# Altium schematic sheet Voltage_Booster.SchDoc
size 508 x 241 mm
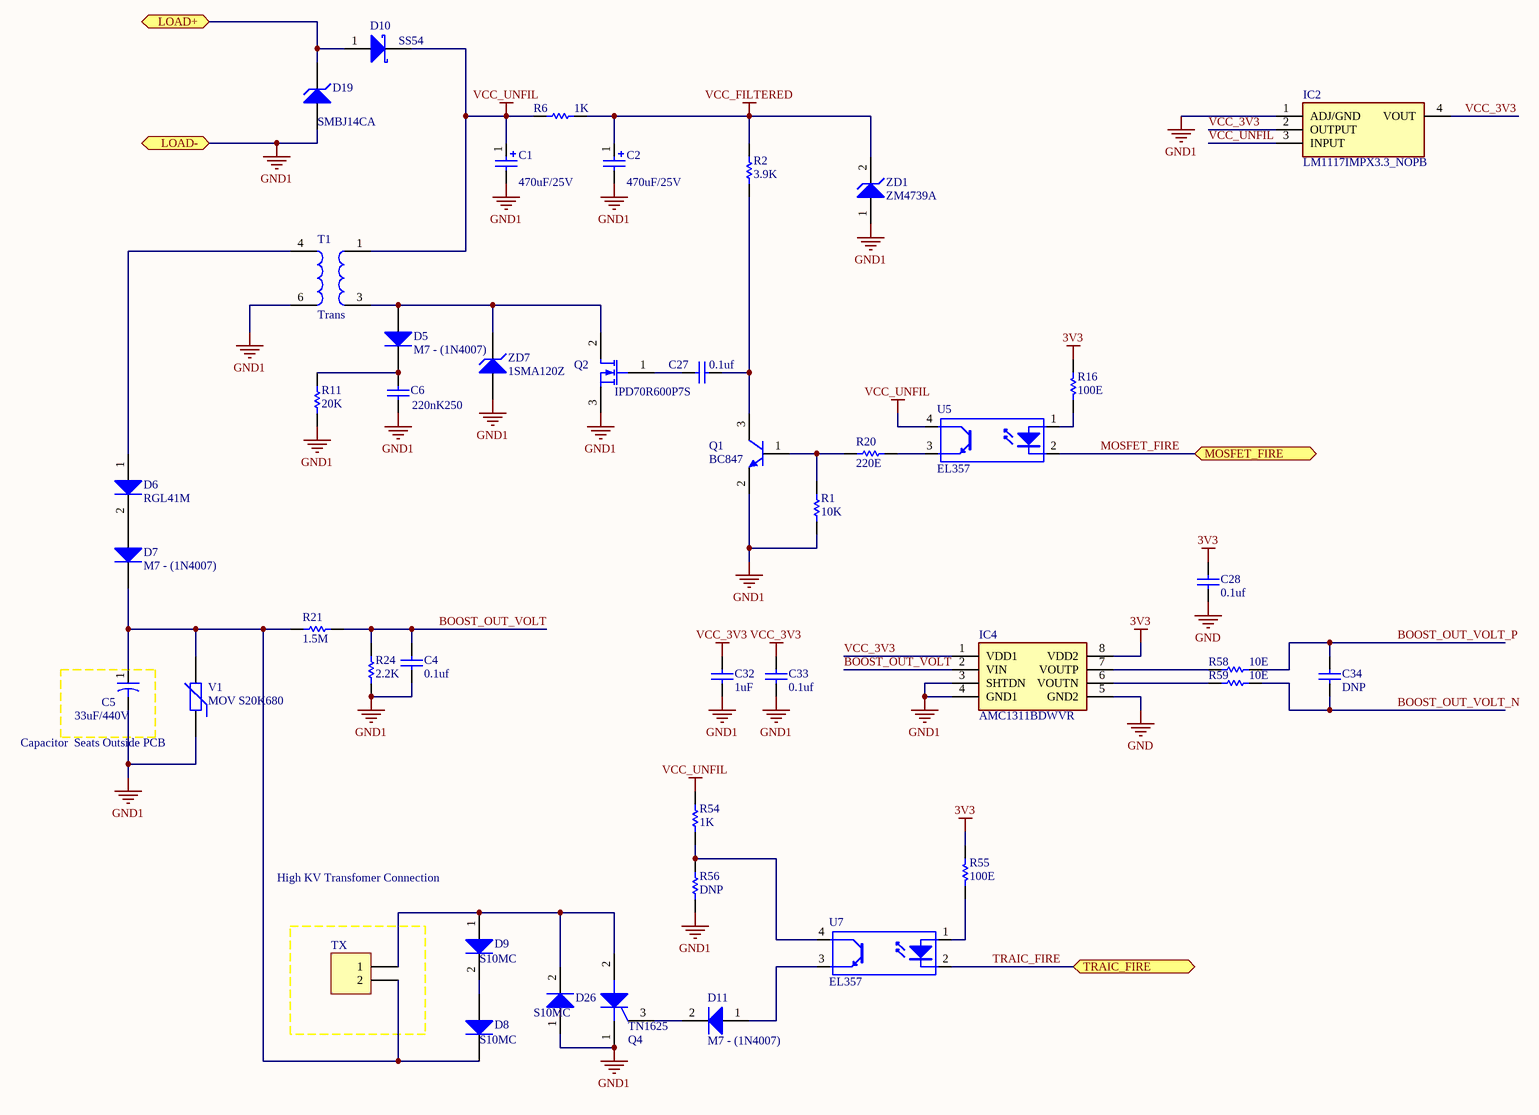
[diagram p0: Voltage_Booster.SchDoc]

## Parts
C1  value 470uF/25V  [Cap_470uf_10X10.2mm]  (hidden comment: Cap Pol1)
C2  value 470uF/25V  [Cap_470uf_10X10.2mm]  (hidden comment: Cap Pol1)
C4  value 0.1uf  [0805]  (hidden comment: Cap)
C5  value 33uF/440V  [ENERGIZER_CONNECTOR]  (hidden comment: Cap2)
C6  value 220nK250  [RES AXIAL-0.6]  (hidden comment: Cap)
C27  value 0.1uf  [0805]  (hidden comment: Cap)
C28  value 0.1uf  [0805]  (hidden comment: Cap)
C32  value 1uF  [0805]  (hidden comment: Cap)
C33  value 0.1uf  [0805]  (hidden comment: Cap)
C34  value DNP  [0805]  (hidden comment: Cap)
D5  M7 - (1N4007)  [SMA]
D6  RGL41M  [DO-213AB]
D7  M7 - (1N4007)  [SMA]
D8  S10MC  [SMC]
D9  S10MC  [SMC]
D10  SS54  [SMC]
D11  M7 - (1N4007)  [SMA]
D19  SMBJ14CA  [SMA]
D26  S10MC  [SMC]
IC2  LM1117IMPX3.3_NOPB  [SOT230P700X180-4N]
IC4  AMC1311BDWVR  [SOIC127P1150X280-8N]
Q1  BC847  [SOT-23]
Q2  IPD70R600P7S  [TO252 (DPAK)]
Q4  TN1625  [D2PAK]
R1  value 10K  [1206]  (hidden comment: Res1)
R2  value 3.9K  [1206]  (hidden comment: Res1)
R6  value 1K  [2512]  (hidden comment: Res1)
R11  value 20K  [1206]  (hidden comment: Res1)
R16  value 100E  [0805]  (hidden comment: Res1)
R20  value 220E  [1206]  (hidden comment: Res1)
R21  value 1.5M  [1206]  (hidden comment: Res1)
R24  value 2.2K  [1206]  (hidden comment: Res1)
R54  value 1K  [1206]  (hidden comment: Res1)
R55  value 100E  [0805]  (hidden comment: Res1)
R56  value DNP  [1206]  (hidden comment: Res1)
R58  value 10E  [0805]  (hidden comment: Res1)
R59  value 10E  [0805]  (hidden comment: Res1)
T1  Trans  [TRANSFORMER_ENERGIZER]
TX  High KV Transfomer Connection  [ENERGIZER_CONNECTOR]
U5  EL357  [SOP4]
U7  EL357  [SOP4]
V1  MOV S20K680  [3225k471]
ZD1  ZM4739A  [SMA]
ZD7  1SMA120Z  [SMA]

## Ports
LOAD+, LOAD-, MOSFET_FIRE, TRAIC_FIRE

## Nets
3V3: C28.2 IC4.8(VDD2) R16.2 R55.2
GND: C28.1 IC4.5(GND2)
GND1: C1.2 C2.2 C4.1 C5.2 C6.1 C32.1 C33.1 D19.1(A) D26.1(A) IC2.1(ADJ/GND) IC4.3(SHTDN) IC4.4(GND1) Q1.2(E) Q2.3(S) Q4.1(K) R1.2 R11.1 R24.2 R56.1 T1.6 V1.1 ZD1.1(A) ZD7.1(A) ; port LOAD-
VCC_3V3: C32.2 C33.2 IC2.2(OUTPUT) IC2.4(VOUT) IC4.1(VDD1)
VCC_FILTERED: C2.1 R2.2 R6.2 ZD1.2(K)
VCC_UNFIL: C1.1 D10.2 IC2.3(INPUT) R6.1 R54.2 T1.1 U5.4(C)
BOOST_OUT_VOLT: C4.2 IC4.2(VIN) R21.2 R24.1
BOOST_OUT_VOLT_N: C34.1 R59.2
BOOST_OUT_VOLT_P: C34.2 R58.2
LOAD+: D10.1(A) D19.2(K) ; port LOAD+
MOSFET_FIRE: U5.2(K) ; port MOSFET_FIRE
TRAIC_FIRE: U7.2(K) ; port TRAIC_FIRE
NetC5_1: C5.1 D7.2(K) D8.2(K) R21.1 TX.2 V1.2
NetC6_2: C6.2 D5.2(K) R11.2
NetC27_1: C27.1 Q1.3(C) R2.1
NetC27_2: C27.2 Q2.1(G)
NetD5_1: D5.1(A) Q2.2(D) T1.3 ZD7.2(K)
NetD6_1: D6.1(A) T1.4
NetD6_2: D6.2(K) D7.1(A)
NetD8_1: D8.1(A) D9.2(K)
NetD9_1: D9.1(A) D26.2(K) Q4.2(A) TX.1
NetD11_1: D11.1(A) U7.3(E)
NetD11_2: D11.2(K) Q4.3(G)
NetIC4_6: IC4.6(VOUTN) R59.1
NetIC4_7: IC4.7(VOUTP) R58.1
NetQ1_1: Q1.1(B) R1.1 R20.1
NetR16_1: R16.1 U5.1(A)
NetR20_2: R20.2 U5.3(E)
NetR54_1: R54.1 R56.2 U7.4(C)
NetR55_1: R55.1 U7.1(A)

## Notes on the sheet
- Capacitor  Seats Outside PCB

## Library data of the parts
C1 C2 = Cap Pol1: Polarized Capacitor (Radial); Published: 8-Jun-2000; LatestRevisionDate: 17-Jul-2002; LatestRevisionNote: Re-released for DXP Platform.; PackageReference: RB7.6-15; Publisher: Altium Limited; PackageDescription: Polarized Capacitor (Radial); 2 Leads
C4 C6 C27 C28 C32-C34 = Cap: Capacitor; Published: 8-Jun-2000; LatestRevisionDate: 17-Jul-2002; LatestRevisionNote: Re-released for DXP Platform.; PackageReference: RAD-0.3; Publisher: Altium Limited; PackageDescription: Radial Cap, Thru-Hole; 2 Leads; 0.3 in Pin Spacing
C5 = Cap2: Capacitor; Published: 23-Sep-2002; PackageReference: CAPR5-4X5; Publisher: Altium Limited; PackageDescription: Capacitor; 2 Leads
D5-D7 = Diode 1N5408: 3 Amp Medium Power Silicon Rectifier Diode; Published: 8-Jun-2000; LatestRevisionDate: 17-Jul-2002; LatestRevisionNote: Re-released for DXP Platform.; DatasheetVersion: Aug-1984; PackageReference: DO-201AD; Publisher: Altium Limited; PackageDescription: Diode, Axial; Body 9.5 x 5.3 mm (LxDia. max), Lead Dia. 1.32 mm (max); ComponentLink1Description: Manufacturer Link; ComponentLink1URL: http://www.irf.com/
D8 D9 = Diode: Default Diode; Published: 8-Jun-2000; LatestRevisionDate: 17-Jul-2002; LatestRevisionNote: Re-released for DXP Platform.; PackageVersion: Sep-1996; PackageReference: SMC; Publisher: Altium Limited; PackageDescription: DO-214-AB/SMC; 2 C-Bend Leads; Body 7.9 x 5.9 mm, inc. leads (LxW); Code_JEDEC: DO-214-AB
D10 = Diode BAT17: Silicon RF Schottky Diode for Mixer Applications in the VHF/UHF Range; Note: Pin 2 is not connected and not drawn.; Published: 21-Mar-2003; LatestRevisionDate: 29-May-2009; LatestRevisionNote: IPC-7351 Footprint Added.; DatasheetVersion: Oct-1999; PackageVersion: Sep-2001; PackageReference: SOT-23; Publisher: Altium Limited; PackageDescription: 3-Pin SOT-23 Package 0.95 mm Pitch, 2.5 mm Lead Span; ComponentLink1Description: Manufacturer Link; ComponentLink1URL: http://www.infineon.com/; ComponentLink2Description: Datasheet; ComponentLink2URL: http://www.infineon.com/upload/Document/cmc_upload/documents/009/363/bat17series.pdf
D11 = Diode 1N4007: 1 Amp General Purpose Rectifier; Published: 8-Jun-2000; LatestRevisionDate: 17-Jul-2002; LatestRevisionNote: Re-released for DXP Platform.; DatasheetVersion: 1998; PackageVersion: Aug-1999; PackageReference: DO-41; Publisher: Altium Limited; PackageDescription: Diode, Axial; Body 5.2 x 2.7 mm (LxDia. max), Lead Dia. 0.86 mm (max); Code_JEDEC: DO-204-AL; ComponentLink1Description: Manufacturer Link; ComponentLink1URL: http://www.fairchildsemi.com/; ComponentLink2Description: Datasheet; ComponentLink2URL: http://www.fairchildsemi.com/ds/1N%2F1N4001.pdf
D19 ZD7 = D Zener: Zener Diode; Published: 8-Jun-2000; LatestRevisionDate: 17-Jul-2002; LatestRevisionNote: Re-released for DXP Platform.; PackageReference: DIODE-0.7; Publisher: Altium Limited; PackageDescription: Diode, Thru-Hole; 2 Leads; 0.7 in Pin Spacing
D26 = Diode 1N4007: Diode P600M; Published: 8-Jun-2000; LatestRevisionDate: 17-Jul-2002; LatestRevisionNote: Re-released for DXP Platform.; DatasheetVersion: 1998; PackageVersion: Aug-1999; PackageReference: DO-41; Publisher: Altium Limited; PackageDescription: Diode, Axial; Body 5.2 x 2.7 mm (LxDia. max), Lead Dia. 0.86 mm (max); Code_JEDEC: DO-204-AL; ComponentLink1Description: Manufacturer Link; ComponentLink1URL: http://www.fairchildsemi.com/; ComponentLink2Description: Datasheet; ComponentLink2URL: http://www.fairchildsemi.com/ds/1N%2F1N4001.pdf
IC2 = LM1117IMPX3.3_NOPB: Integrated Circuit; Manufacturer_Name: Texas Instruments; Manufacturer_Part_Number: LM1117IMPX3.3/NOPB; Datasheet Link: http://www.ti.com/lit/ds/symlink/lm1117.pdf; Height: 1.8mm
IC4 = AMC1311BDWVR: Integrated Circuit; Manufacturer_Name: Texas Instruments; Datasheet Link: http://www.ti.com/lit/gpn/amc1311; Height: 2.8mm; Manufacturer_Part_Number: AMC1311BDWVR; Mouser Part Number: 595-AMC1311BDWVR; Mouser Price/Stock: https://www.mouser.co.uk/ProductDetail/Texas-Instruments/AMC1311BDWVR/?qs=W0yvOO0ixfFQekR98E4CkQ%3D%3D; Arrow Part Number: AMC1311BDWVR; Arrow Price/Stock: https://www.arrow.com/en/products/amc1311bdwvr/texas-instruments
Q1 = 2N3904: NPN General Purpose Amplifier; Published: 8-Jun-2000; LatestRevisionDate: 15-Jan-2003; LatestRevisionNote: PCB Footprint 'BCY-W3/D4.7' replaced; DatasheetVersion: 1997; PackageVersion: Sep-1998; PackageReference: TO-92A; Publisher: Altium Limited; PackageDescription: TO, Flat Index; 3 In-Line, Axial Leads; Body Dia. 4.5mm; Leads 0.51 x 0.48 mm (max); ComponentLink1Description: Manufacturer Link; ComponentLink1URL: http://www.fairchildsemi.com/; ComponentLink2Description: Datasheet; ComponentLink2URL: http://www.fairchildsemi.com/ds/2N%2F2N3904.pdf
Q2 = MOSFET-N: N-Channel MOSFET; Published: 8-Jun-2000; LatestRevisionDate: 17-Jul-2002; LatestRevisionNote: Re-released for DXP Platform.; PackageVersion: 1995/1996; PackageReference: E3; Publisher: Altium Limited; PackageDescription: TO, Flat Index; 3 In-Line, Axial Leads; Body Dia. 4.6mm; Lead Dia. 0.5 mm (max)
Q4 = SCR: Silicon Controlled Rectifier; Published: 8-Jun-2000; LatestRevisionDate: 17-Jul-2002; LatestRevisionNote: Re-released for DXP Platform.; PackageReference: TO-220-AB; Publisher: Altium Limited; Code_JEDEC: TO-220-AB
R1 R2 R6 R11 R16 R20 R21 R24 R54-R56 R58 R59 = Res1: Resistor; Published: 8-Jun-2000; LatestRevisionDate: 17-Jul-2002; LatestRevisionNote: Re-released for DXP Platform.; PackageReference: AXIAL-0.3; Publisher: Altium Limited; PackageDescription: Axial Device, Thru-Hole; 2 Leads; 0.3 in Pin Spacing
T1 = Trans: Transformer For Voltage Booster; Published: 24-Mar-1999; LatestRevisionDate: 08-Jul-2005; LatestRevisionNote: Mech Layer 1 removed.; PackageReference: TRANS; Publisher: Altium Limited; PackageDescription: Transformer; 4 Leads
TX = Header 2: Header, 2-Pin; LatestRevisionDate: 17-Jul-2002; LatestRevisionNote: Re-released for DXP Platform.; Publisher: Altium Limited
U5 U7 = Optoisolator1: 4-Pin Phototransistor Optocoupler; Published: 24-Mar-1999; LatestRevisionDate: 04-Mar-2005; LatestRevisionNote: Sch pins 3 & 4 Swapped.; DatasheetVersion: Nov-2003; PackageReference: DIP-4; Publisher: Altium Limited
V1 = Res Varistor: Varistor (Voltage-Sensitive Resistor); Published: 24-Mar-1999; LatestRevisionDate: 29-May-2009; LatestRevisionNote: IPC-7351 Footprint Added.; PackageVersion: Mar-2003; PackageReference: 6-0805; Publisher: Altium Limited; PackageDescription: Chip Resistor 0805 Case Size; Code_IPC: RESC2012
ZD1 = D Zener: Zener Diode; Value: 9.8V; Published: 8-Jun-2000; LatestRevisionDate: 17-Jul-2002; LatestRevisionNote: Re-released for DXP Platform.; PackageReference: DIODE-0.7; Publisher: Altium Limited; PackageDescription: Diode, Thru-Hole; 2 Leads; 0.7 in Pin Spacing